# Altium project warm-board.PrjPcb
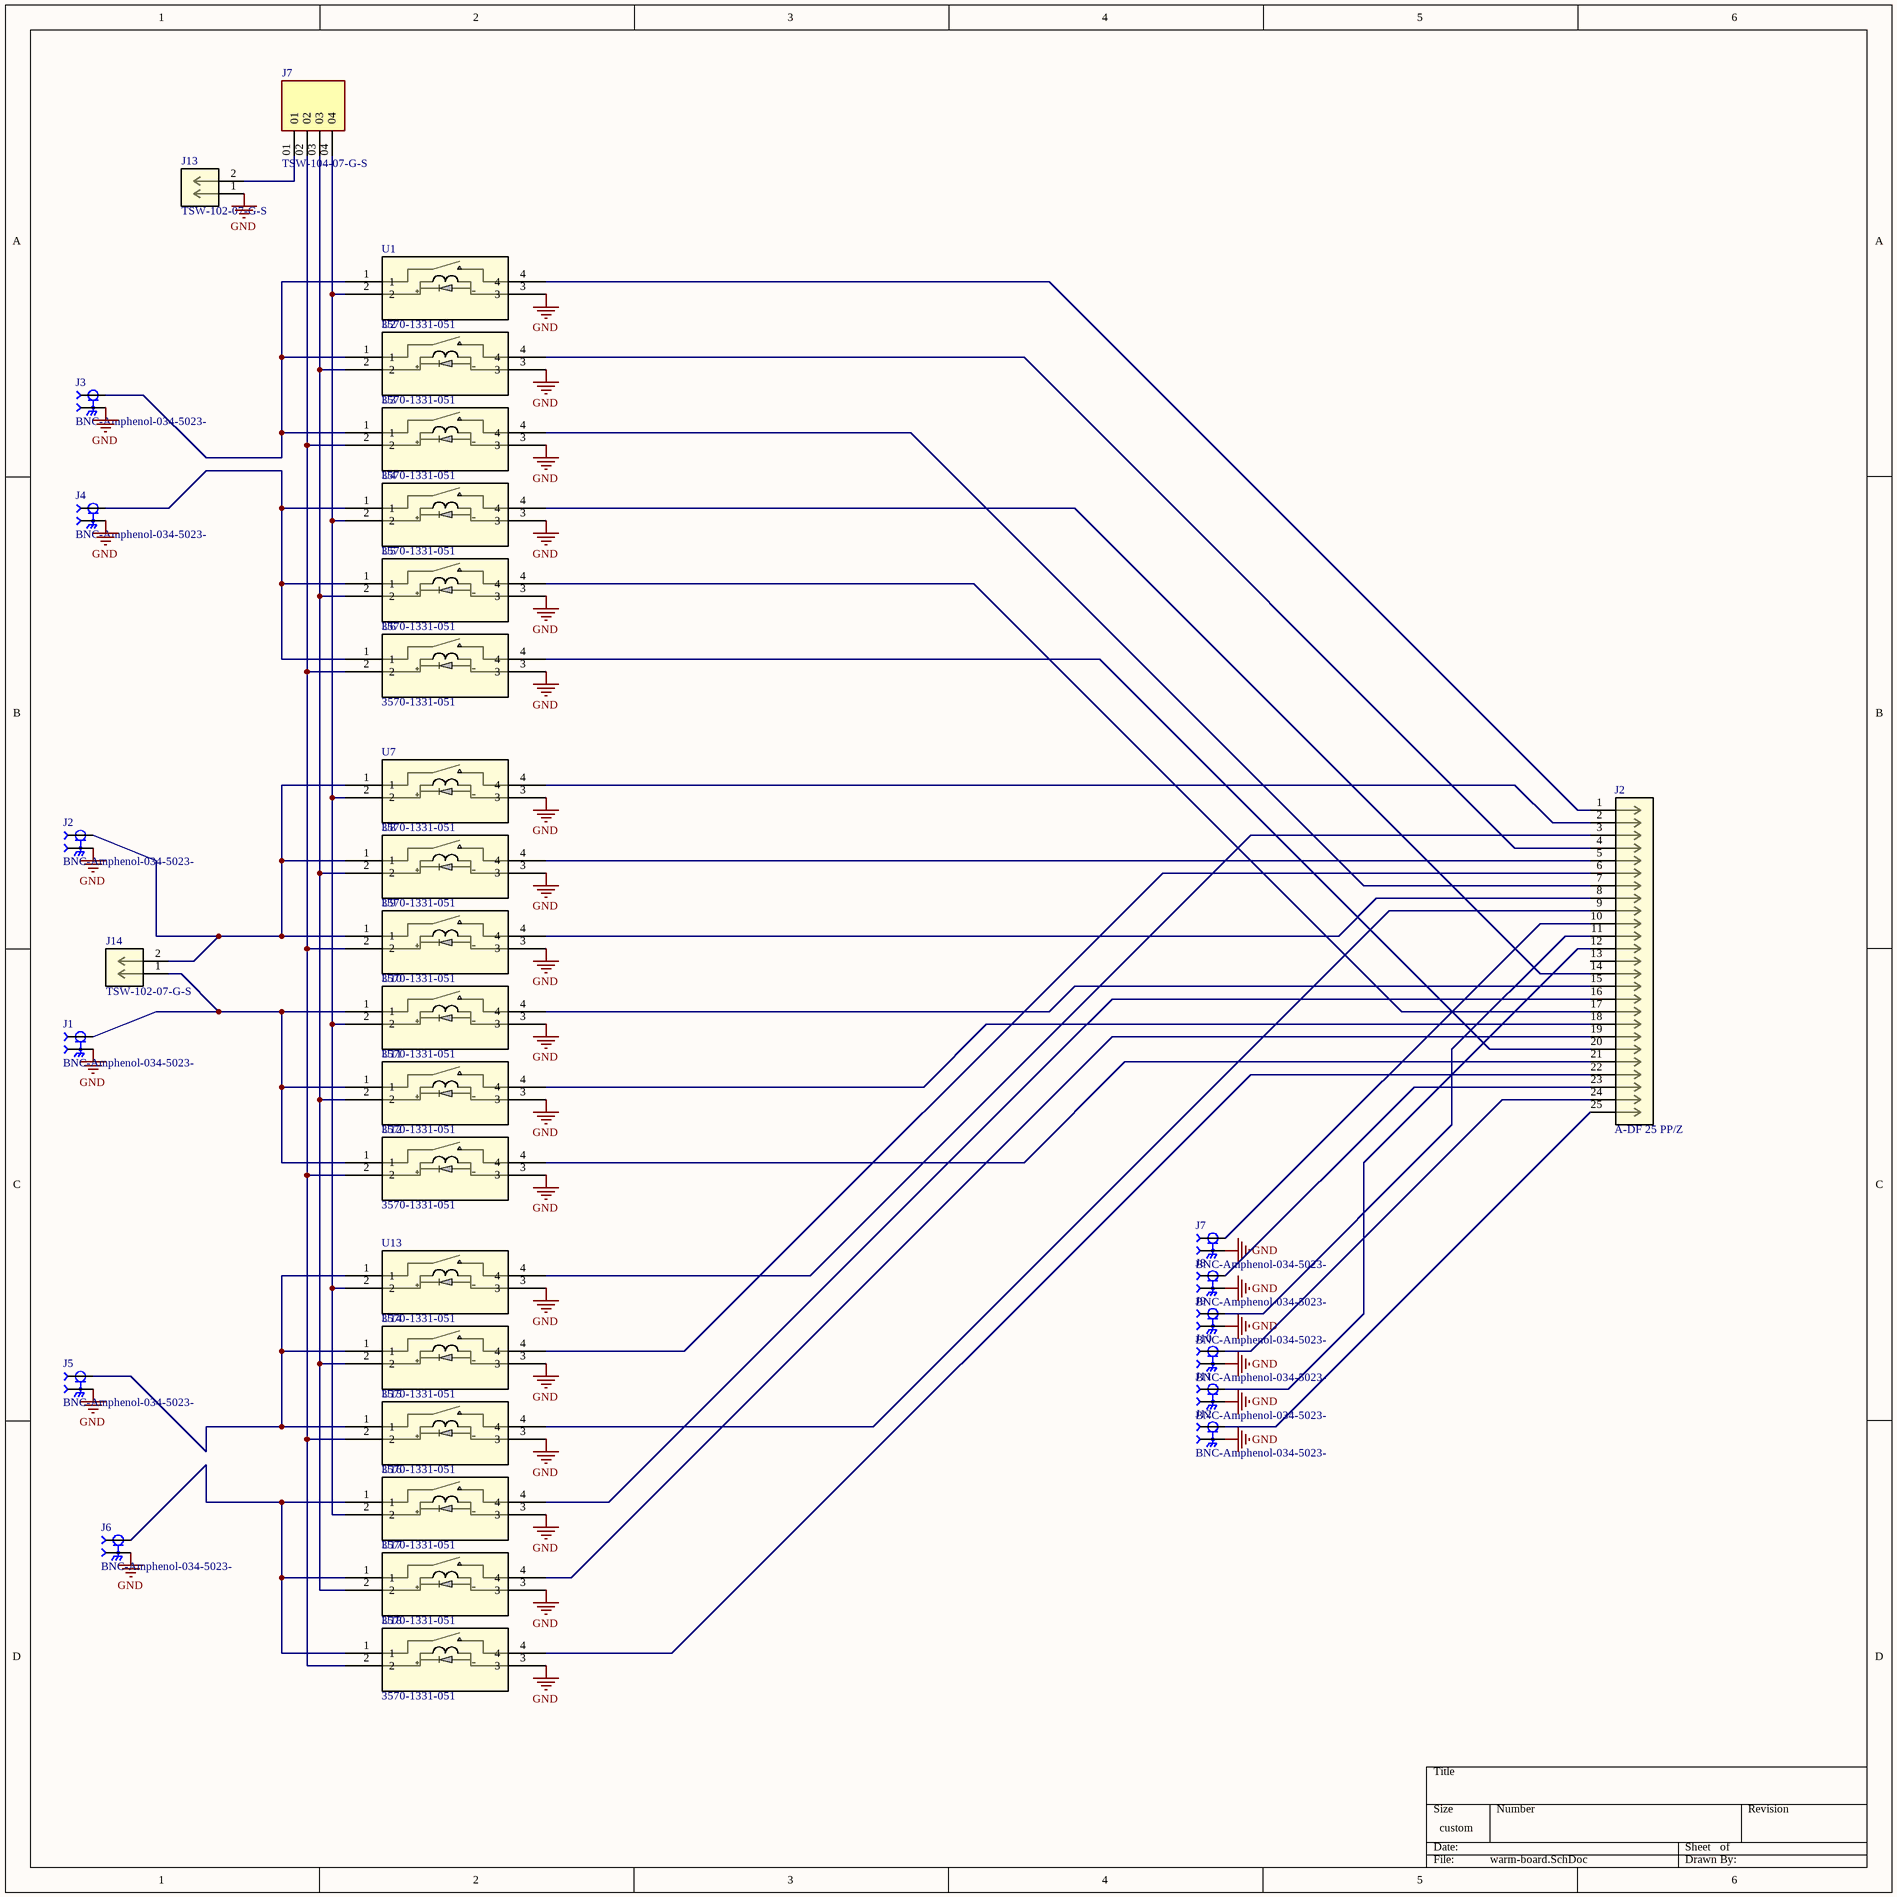
[diagram p0: warm-board.SchDoc]
1 sheet, 34 parts. Net scope: global (net labels, ports and power ports of the same name join across sheets).
Board file: warm-pcb.PcbDoc

## Sheet warm-board.SchDoc
size 381 x 381 mm; SheetNumber: 1; SheetTotal: 1

### Parts
(Parts that share a designator on the sheet are numbered #1, #2 ... from top to bottom, then left to right.)
J1  BNC-Amphenol-034-5023-  [BNC-Amphenol-034-5023-]
J2#1  A-DF 25 PP/Z  [CONN_A-DF 25 PPZ_ASM]
J2#2  BNC-Amphenol-034-5023-  [BNC-Amphenol-034-5023-]
J3  BNC-Amphenol-034-5023-  [BNC-Amphenol-034-5023-]
J4  BNC-Amphenol-034-5023-  [BNC-Amphenol-034-5023-]
J5  BNC-Amphenol-034-5023-  [BNC-Amphenol-034-5023-]
J6  BNC-Amphenol-034-5023-  [BNC-Amphenol-034-5023-]
J7#1  TSW-104-07-G-S  [SAMTEC_TSW-104-07-G-S]
J7#2  BNC-Amphenol-034-5023-  [BNC-Amphenol-034-5023-]
J8  BNC-Amphenol-034-5023-  [BNC-Amphenol-034-5023-]
J9  BNC-Amphenol-034-5023-  [BNC-Amphenol-034-5023-]
J10  BNC-Amphenol-034-5023-  [BNC-Amphenol-034-5023-]
J11  BNC-Amphenol-034-5023-  [BNC-Amphenol-034-5023-]
J12  BNC-Amphenol-034-5023-  [BNC-Amphenol-034-5023-]
J13  TSW-102-07-G-S  [CON2_1X2_TU_TSW]
J14  TSW-102-07-G-S  [CON2_1X2_TU_TSW]
U1  3570-1331-051  [SIP_3570-1331_COM]
U2  3570-1331-051  [SIP_3570-1331_COM]
U3  3570-1331-051  [SIP_3570-1331_COM]
U4  3570-1331-051  [SIP_3570-1331_COM]
U5  3570-1331-051  [SIP_3570-1331_COM]
U6  3570-1331-051  [SIP_3570-1331_COM]
U7  3570-1331-051  [SIP_3570-1331_COM]
U8  3570-1331-051  [SIP_3570-1331_COM]
U9  3570-1331-051  [SIP_3570-1331_COM]
U10  3570-1331-051  [SIP_3570-1331_COM]
U11  3570-1331-051  [SIP_3570-1331_COM]
U12  3570-1331-051  [SIP_3570-1331_COM]
U13  3570-1331-051  [SIP_3570-1331_COM]
U14  3570-1331-051  [SIP_3570-1331_COM]
U15  3570-1331-051  [SIP_3570-1331_COM]
U16  3570-1331-051  [SIP_3570-1331_COM]
U17  3570-1331-051  [SIP_3570-1331_COM]
U18  3570-1331-051  [SIP_3570-1331_COM]

### Nets
GND: J1.gnd J2#2.gnd J3.gnd J4.gnd J5.gnd J6.gnd J7#2.gnd J8.gnd J9.gnd J10.gnd J11.gnd J12.gnd J13.1 U1.3 U2.3 U3.3 U4.3 U5.3 U6.3 U7.3 U8.3 U9.3 U10.3 U11.3 U12.3 U13.3 U14.3 U15.3 U16.3 U17.3 U18.3
NetJ1_ctr: J1.ctr J14.1 U10.1 U11.1 U12.1
NetJ2#1_1: J2#1.1 U1.4
NetJ2#1_2: J2#1.2 U7.4
NetJ2#1_3: J2#1.3 U13.4
NetJ2#1_4: J2#1.4 U2.4
NetJ2#1_5: J2#1.5 U8.4
NetJ2#1_6: J2#1.6 U14.4
NetJ2#1_7: J2#1.7 U3.4
NetJ2#1_8: J2#1.8 U9.4
NetJ2#1_9: J2#1.9 U15.4
NetJ2#1_10: J2#1.10 J7#2.ctr
NetJ2#1_11: J2#1.11 J9.ctr
NetJ2#1_12: J2#1.12 J11.ctr
NetJ2#1_14: J2#1.14 U4.4
NetJ2#1_15: J2#1.15 U10.4
NetJ2#1_16: J2#1.16 U16.4
NetJ2#1_17: J2#1.17 U5.4
NetJ2#1_18: J2#1.18 U11.4
NetJ2#1_19: J2#1.19 U17.4
NetJ2#1_20: J2#1.20 U6.4
NetJ2#1_21: J2#1.21 U12.4
NetJ2#1_22: J2#1.22 U18.4
NetJ2#1_23: J2#1.23 J8.ctr
NetJ2#1_24: J2#1.24 J10.ctr
NetJ2#1_25: J2#1.25 J12.ctr
NetJ2#2_ctr: J2#2.ctr J14.2 U7.1 U8.1 U9.1
NetJ3_ctr: J3.ctr U1.1 U2.1 U3.1
NetJ4_ctr: J4.ctr U4.1 U5.1 U6.1
NetJ5_ctr: J5.ctr U13.1 U14.1 U15.1
NetJ6_ctr: J6.ctr U16.1 U17.1 U18.1
NetJ7#1_01: J7#1.01 J13.2
NetJ7#1_02: J7#1.02 U3.2 U6.2 U9.2 U12.2 U15.2 U18.2
NetJ7#1_03: J7#1.03 U2.2 U5.2 U8.2 U11.2 U14.2 U17.2
NetJ7#1_04: J7#1.04 U1.2 U4.2 U7.2 U10.2 U13.2 U16.2

Not connected (* = marked no-connect by the designer): J2#1 13

### Library data of the parts
J1 J2#2 J3-J6 J7#2 J8-J12 = BNC-Amphenol-034-5023-: BNC panel mount thru hole; MF: Samtec; MP: SMA-J-P-H-ST-TH1; Package: None; Value: *; Price: None; Toby_UK-Purchase-URL: https://snapeda.com/shop?store=Toby+UK&id=134499; DigiKey-Purchase-URL: https://snapeda.com/shop?store=DigiKey&id=134499; Availability: Unavailable; SnapEDA_Link: https://www.snapeda.com/parts/SMA-J-P-H-ST-TH1/Samtec%20Inc./view-part/134499/?ref=snap; Supplier 1: Newark; Supplier Part Number 1: 90W0187
J2#1 = A-DF 25 PPZ: No Description Available; Mfr_Name: Assmann; Copyright: Copyright (C) 2024 Ultra Librarian. All rights reserved.; Manufacturer_Part_Number: A-DF 25 PP/Z; RefDes: RefDes; Type: DEV
J7#1 = TSW-104-07-G-S: <a href="https://pricing.snapeda.com/parts/TSW-104-07-G-S/Samtec/view-part?ref=eda">Check availability</a>; MP: altium_native_batch; Package: None; Price: None; Value: *; Availability: Unavailable
J13 J14 = TSW-102-07-G-S: No Description Available; Mfr_Name: Samtec Inc; Copyright: Copyright (C) 2024 Ultra Librarian. All rights reserved.; Manufacturer_Part_Number: TSW-102-07-G-S; RefDes: RefDes; Type: DEV
U1-U18 = 3570-1331-051: No Description Available; Mfr_Name: Comus; Copyright: Copyright (C) 2024 Ultra Librarian. All rights reserved.; Manufacturer_Part_Number: 3570-1331-051; RefDes: RefDes; Type: DEV